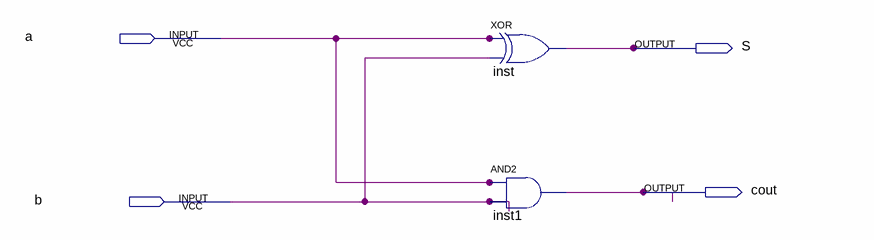
[diagram p0: schematic sheet]
// Quartus schematic bfs_ha.bdf as structural Verilog: 2 symbols, 4 pins
module bfs_ha (
  input  a,
  input  b,
  output S,
  output cout
);

  xor inst (S, a, b);
  and inst1 (cout, a, b);
endmodule
